# EasyEDA schematic SCH_SYNTH_2024-10-22.json
TITLE: Sheet_1; REV: 1.0; Date: 2024-10-18; Sheet: 1/1; Drawn By: Aline744; Company: Your Company
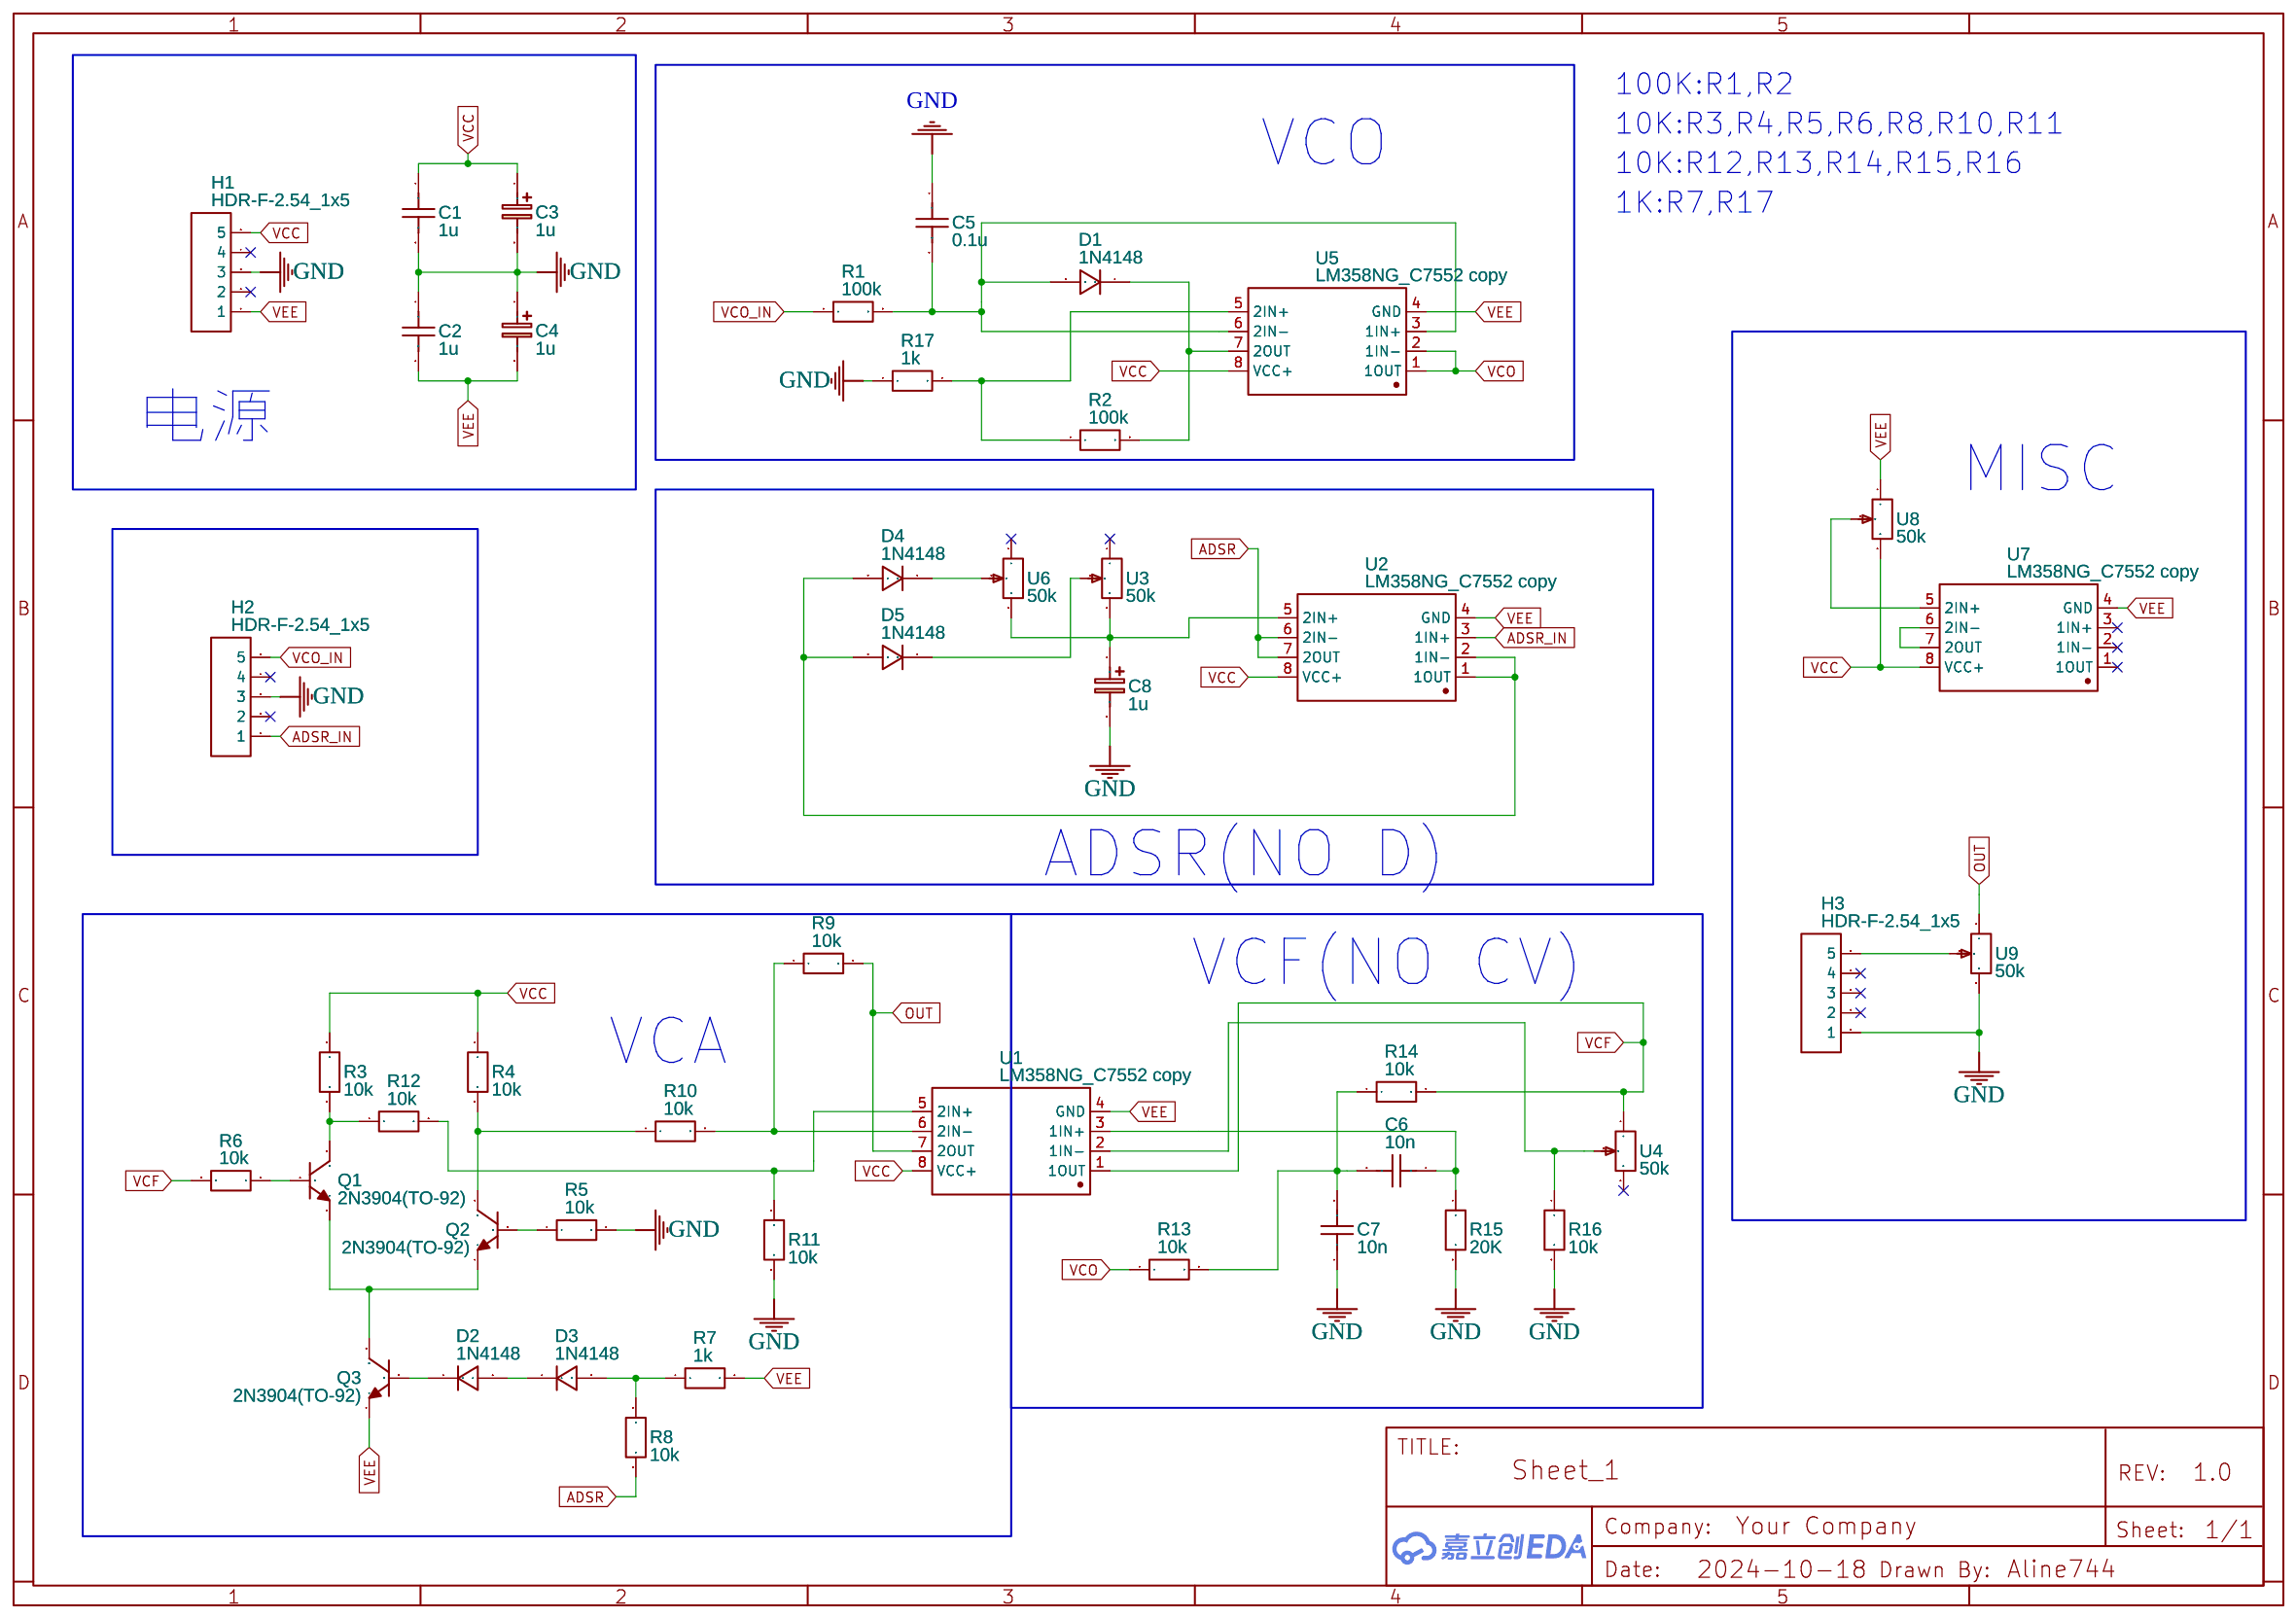
[diagram p0: schematic sheet]

## Parts
C1  1u  [RAD-0.2]
C2  1u  [RAD-0.2]
C3  1u  [CAP-D8.0×F3.5]
C4  1u  [CAP-D8.0×F3.5]
C5  0.1u  [RAD-0.2]
C6  10n  [RAD-0.2]
C7  10n  [RAD-0.2]
C8  1u  [CAP-D8.0×F3.5]
D1  1N4148  [DO-35_BD2.0-L4.2-P8.20-D0.5-RD]
D2  1N4148  [DO-35_BD2.0-L4.2-P8.20-D0.5-RD]
D3  1N4148  [DO-35_BD2.0-L4.2-P8.20-D0.5-RD]
D4  1N4148  [DO-35_BD2.0-L4.2-P8.20-D0.5-RD]
D5  1N4148  [DO-35_BD2.0-L4.2-P8.20-D0.5-RD]
H1  HDR-F-2.54_1x5  [HDR-F-2.54_1X5]
H2  HDR-F-2.54_1x5  [HDR-F-2.54_1X5]
H3  HDR-F-2.54_1x5  [HDR-F-2.54_1X5]
Q1  2N3904(TO-92)  [TO-92-3_L5.1-W4.1-P1.27-L]
Q2  2N3904(TO-92)  [TO-92-3_L5.1-W4.1-P1.27-L]
Q3  2N3904(TO-92)  [TO-92-3_L5.1-W4.1-P1.27-L]
R1  100k  [R_AXIAL-0.3]
R2  100k  [R_AXIAL-0.3]
R3  10k  [R_AXIAL-0.3]
R4  10k  [R_AXIAL-0.3]
R5  10k  [R_AXIAL-0.3]
R6  10k  [R_AXIAL-0.3]
R7  1k  [R_AXIAL-0.3]
R8  10k  [R_AXIAL-0.3]
R9  10k  [R_AXIAL-0.3]
R10  10k  [R_AXIAL-0.3]
R11  10k  [R_AXIAL-0.3]
R12  10k  [R_AXIAL-0.3]
R13  10k  [R_AXIAL-0.3]
R14  10k  [R_AXIAL-0.3]
R15  20K  [R_AXIAL-0.3]
R16  10k  [R_AXIAL-0.3]
R17  1k  [R_AXIAL-0.3]
U1  LM358NG_C7552 copy  [DIP8]
U2  LM358NG_C7552 copy  [DIP8]
U3  50k  [蓝白可调电阻]
U4  50k  [蓝白可调电阻]
U5  LM358NG_C7552 copy  [DIP8]
U6  50k  [蓝白可调电阻]
U7  LM358NG_C7552 copy  [DIP8]
U8  50k  [蓝白可调电阻]
U9  50k  [蓝白可调电阻]

## Library data of the parts
C1 C2 C5-C7 = C_RAD-0.2_US: Contributor: LCEDA_Lib
C3 C4 C8 = CE_TH_D8.0×F3.5_EU: Contributor: LCEDA_Lib
D1-D5 = 1N4148: Supplier: LCSC; Supplier Part: C13769; Manufacturer: STMicroelectronics; Contributor: LCSC
H1-H3 = HDR-F-2.54_1x5: Supplier Part: C50950; Supplier: LCSC; Contributor: LCEDA_Lib
Q1-Q3 = 2N3904(TO-92): Supplier: LCSC; Manufacturer: SEMTECH; Manufacturer Part: 2N3904; Supplier Part: C118538; Contributor: LCEDA_Lib
R1-R17 = R_AXIAL-0.3_EU: Contributor: LCEDA_Lib
U1 U2 U5 U7 = LM358NG_C7552 copy: Supplier Part: C7552; Supplier: LCSC; Manufacturer: ON; Contributor: guweima
U3 U4 U6 U8 U9 = 蓝白可调电阻: Contributor: yy..5300

## Nets
GND: C1.2 C2.1 C3.2 C4.1 C5.1 C7.1 C8.2 H1.3 H2.3 H3.1 R5.2 R11.2 R15.2 R16.2 R17.1 U9.2
VCC: C1.1 C3.1 H1.5 R3.1 R4.1 U1.8(VCC+) U2.8(VCC+) U5.8(VCC+) U7.8(VCC+) U8.2
VEE: C2.2 C4.2 H1.1 Q3.1(E) R7.2 U1.4(GND) U2.4(GND) U5.4(GND) U7.4(GND) U8.1
ADSR: R8.2 U2.6(2IN-) U2.7(2OUT)
ADSR_IN: H2.1 U2.3(1IN+)
OUT: R9.2 U1.7(2OUT) U9.1
VCF: R6.2 R14.2 U1.1(1OUT) U4.1
VCO: R13.1 U5.1(1OUT) U5.2(1IN-)
VCO_IN: H2.5 R1.1
Net-(C5-2): C5.2 D1.2 R1.2 U5.3(1IN+) U5.6(2IN-)
Net-(C6-1): C6.1 R15.1 U1.3(1IN+)
Net-(C6-2): C6.2 C7.2 R13.2 R14.1
Net-(C8-1): C8.1 U2.5(2IN+) U3.2 U6.2
Net-(D1-1): D1.1 R2.2 U5.7(2OUT)
Net-(D2-1): D2.1 Q3.2(B)
Net-(D2-2): D2.2 D3.1
Net-(D3-2): D3.2 R7.1 R8.1
Net-(D4-1): D4.1 U6.3
Net-(D4-2): D4.2 D5.2 U2.1(1OUT) U2.2(1IN-)
Net-(D5-1): D5.1 U3.3
Net-(H3-5): H3.5 U9.3
Net-(Q1-1): Q1.1(E) Q2.1(E) Q3.3(C)
Net-(Q1-2): Q1.2(B) R6.1
Net-(Q1-3): Q1.3(C) R3.2 R12.1
Net-(Q2-2): Q2.2(B) R5.1
Net-(Q2-3): Q2.3(C) R4.2 R10.1
Net-(R2-1): R2.1 R17.2 U5.5(2IN+)
Net-(R9-1): R9.1 R10.2 U1.6(2IN-)
Net-(R11-1): R11.1 R12.2 U1.5(2IN+)
Net-(R16-1): R16.1 U1.2(1IN-) U4.3
Net-(U7-5): U7.5(2IN+) U8.3
Net-(U7-6): U7.6(2IN-) U7.7(2OUT)

Not connected (* = marked no-connect by the designer): H1 2* 4*; H2 2* 4*; H3 2* 3* 4*; U3 1*; U4 2*; U6 1*; U7 1(1OUT)* 2(1IN-)* 3(1IN+)*

## Notes on the sheet
- 100K:R1,R2
- VCO
- 10K:R3,R4,R5,R6,R8,R10,R11
- 10K:R12,R13,R14,R15,R16
- 1K:R7,R17
- 电源
- MISC
- ADSR(NO D)
- VCF(NO CV)
- VCA
